# EAGLE schematic FinalSchematic_FrankensToy_FabAcademy2014_ADLL (EAGLE 6.5.0)
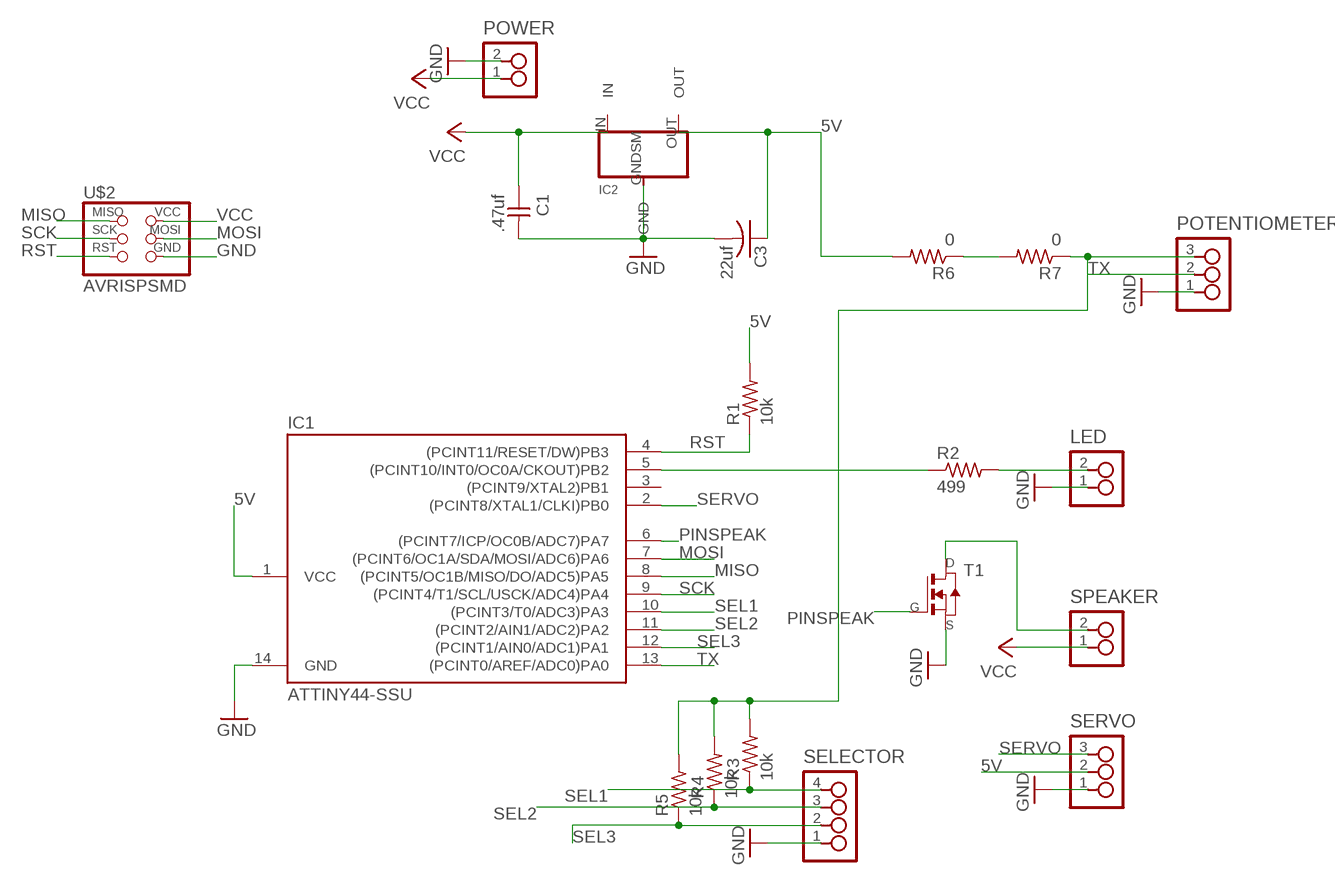
[diagram p0: schematic, sheet 1]

## Parts
C1  .47uf  UNPOLARIZED_CAPACITOR1206  [1206]
C3  22uf  C-USC1206  [C1206]
IC1  ATTINY44-SSU  [SOIC14]
IC2  REGULATOR  [SOT223]
LED  2_PIN_HEADERHEADER  [SMT_PINS_2]
POTENTIOMETER  3_PIN_HEADERHEADER  [SMT_PINS_3]
POWER  2_PIN_HEADERHEADER  [SMT_PINS_2]
R1  10k  R-US_R1206  [R1206]
R2  499  RESISTOR1206  [1206]
R3  10k  R-US_R1206  [R1206]
R4  10k  R-US_R1206  [R1206]
R5  10k  R-US_R1206  [R1206]
R6  0  R-US_R1206  [R1206]
R7  0  R-US_R1206  [R1206]
SELECTOR  4_PIN_HEADERHEADER  [SMT_PINS_4]
SERVO  3_PIN_HEADERHEADER  [SMT_PINS_3]
SPEAKER  2_PIN_HEADERHEADER  [SMT_PINS_2]
T1  NMOSFETSOT23  [SOT-23]
U$2  AVRISPSMD  [2X03SMD]

## Nets
5V: C3.1 IC1.1(VCC) IC2.OUT R1.2 R6.2 SERVO.2
GND: C1.2 C3.2 IC1.14(GND) IC2.GNDSM(GND) LED.1 POTENTIOMETER.1 POWER.2 SELECTOR.1 SERVO.1 T1.2(S) U$2.6(GND)
MISO: IC1.8((PCINT5/OC1B/MISO/DO/ADC5)PA5) U$2.1(MISO)
MOSI: IC1.7((PCINT6/OC1A/SDA/MOSI/ADC6)PA6) U$2.4(MOSI)
N$1: IC1.5((PCINT10/INT0/OC0A/CKOUT)PB2) R2.1
N$2: SPEAKER.2 T1.1(D)
N$3: R6.1 R7.2
N$4: LED.2 R2.2
N$6: POTENTIOMETER.3 R3.2 R4.2 R5.2 R7.1
PINSPEAK: IC1.6((PCINT7/ICP/OC0B/ADC7)PA7) T1.3(G)
RST: IC1.4((PCINT11/RESET/DW)PB3) R1.1 U$2.5(RST)
SCK: IC1.9((PCINT4/T1/SCL/USCK/ADC4)PA4) U$2.3(SCK)
SEL1: IC1.10((PCINT3/T0/ADC3)PA3) R3.1 SELECTOR.4
SEL2: IC1.11((PCINT2/AIN1/ADC2)PA2) R4.1 SELECTOR.3
SEL3: IC1.12((PCINT1/AIN0/ADC1)PA1) R5.1 SELECTOR.2
SERVO: IC1.2((PCINT8/XTAL1/CLKI)PB0) SERVO.3
TX: IC1.13((PCINT0/AREF/ADC0)PA0) POTENTIOMETER.2
VCC: C1.1 IC2.IN POWER.1 SPEAKER.1 U$2.2(VCC)
Unconnected: IC1.3((PCINT9/XTAL2)PB1)

## Library data of the parts
C1 = 01_FAB_Hello:UNPOLARIZED_CAPACITOR: unpolarized_capacitor
C3 = rcl:C-US: CAPACITOR, American symbol
IC1 = fab:ATTINY44
IC2 = 01_ale:REGULATOR
LED POWER SPEAKER = 01_ng:2_PIN_HEADER: 2 SMT pin pads
POTENTIOMETER SERVO = 01_ng:3_PIN_HEADER: 3 SMT pin pads
R1 R3-R7 = resistor:R-US_: RESISTOR, American symbol
R2 = 01_FAB_Hello:RESISTOR
SELECTOR = 01_ng:4_PIN_HEADER: 4 SMT pin pads
T1 = 01_fab:NMOSFET: MOS FET
U$2 = fab:AVRISP